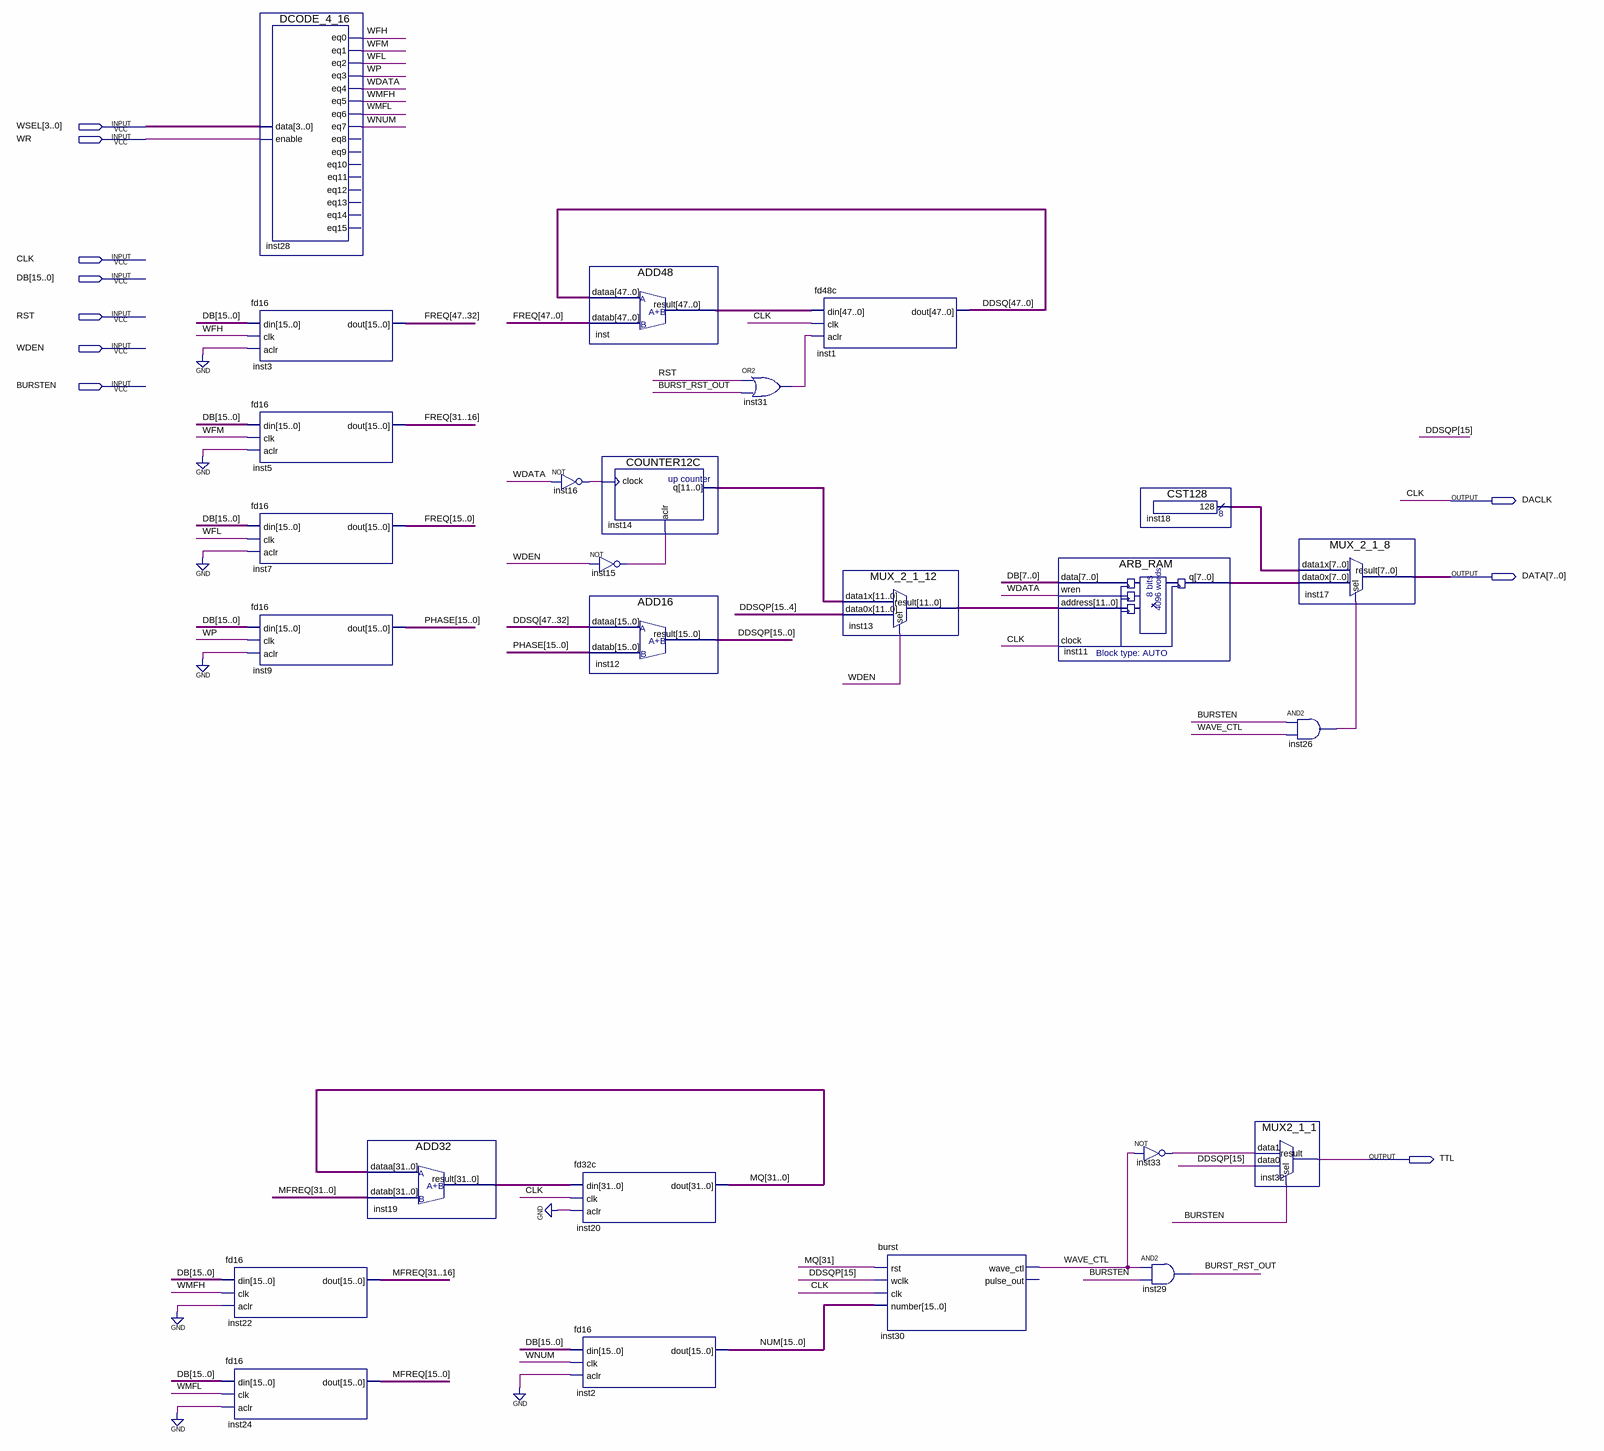
[diagram p0: schematic sheet]
// Quartus schematic DDS.bdf as structural Verilog: 26 symbols, 10 pins
module DDS (
  input  [3:0] WSEL,
  input  WR,
  input  CLK,
  input  [15:0] DB,
  input  RST,
  input  WDEN,
  input  BURSTEN,
  output DACLK,
  output [7:0] DATA,
  output TTL
);

  wire BURST_RST_OUT, inst15_out, inst16_out, inst26_out, inst31_out, inst33_out, WAVE_CTL, WDATA, WFH, WFL,
       WFM, WMFH, WMFL, WNUM, WP;
  wire [7:0] inst11_q, inst18_result;
  wire [11:0] inst13_result, inst14_q;
  wire [15:0] DDSQP, NUM, PHASE;
  wire [31:0] inst19_result, MFREQ, MQ;
  wire [47:0] DDSQ, FREQ, inst_result;

  fd16 inst22 (.din(DB), .clk(WMFH), .aclr(1'b0), .dout(MFREQ[31:16]));
  fd16 inst24 (.din(DB), .clk(WMFL), .aclr(1'b0), .dout(MFREQ[15:0]));
  DCODE_4_16 inst28 (
    .data(WSEL), .enable(WR), .eq0(WFH), .eq1(WFM), .eq2(WFL), .eq3(WP), .eq4(WDATA), .eq5(WMFH), .eq6(WMFL),
    .eq7(WNUM));  // open: eq8, eq9, eq10, eq11, eq12, eq13, eq14, eq15
  fd16 inst3 (.din(DB), .clk(WFH), .aclr(1'b0), .dout(FREQ[47:32]));
  fd16 inst5 (.din(DB), .clk(WFM), .aclr(1'b0), .dout(FREQ[31:16]));
  fd16 inst7 (.din(DB), .clk(WFL), .aclr(1'b0), .dout(FREQ[15:0]));
  fd16 inst9 (.din(DB), .clk(WP), .aclr(1'b0), .dout(PHASE));
  ADD32 inst19 (.dataa(MQ), .datab(MFREQ), .result(inst19_result));
  not inst16 (inst16_out, WDATA);
  fd32c inst20 (.din(inst19_result), .clk(CLK), .aclr(1'b0), .dout(MQ));
  fd16 inst2 (.din(DB), .clk(WNUM), .aclr(1'b0), .dout(NUM));
  ADD48 inst (.dataa(DDSQ), .datab(FREQ), .result(inst_result));
  COUNTER12C inst14 (.clock(inst16_out), .aclr(inst15_out), .q(inst14_q));
  not inst15 (inst15_out, WDEN);
  ADD16 inst12 (.dataa(DDSQ[47:32]), .datab(PHASE), .result(DDSQP));
  or inst31 (inst31_out, RST, BURST_RST_OUT);
  fd48c inst1 (.din(inst_result), .clk(CLK), .aclr(inst31_out), .dout(DDSQ));
  MUX_2_1_12 inst13 (.data1x(inst14_q), .data0x(DDSQP[15:4]), .sel(WDEN), .result(inst13_result));
  burst inst30 (.rst(MQ[31]), .wclk(DDSQP[15]), .clk(CLK), .number(NUM), .wave_ctl(WAVE_CTL));  // open: pulse_out
  ARB_RAM inst11 (.data(DB[7:0]), .wren(WDATA), .address(inst13_result), .clock(CLK), .q(inst11_q));
  not inst33 (inst33_out, WAVE_CTL);
  CST128 inst18 (.result(inst18_result));
  and inst29 (BURST_RST_OUT, WAVE_CTL, BURSTEN);
  and inst26 (inst26_out, BURSTEN, WAVE_CTL);
  MUX2_1_1 inst32 (.data1(inst33_out), .data0(DDSQP[15]), .sel(BURSTEN), .result(TTL));
  MUX_2_1_8 inst17 (.data1x(inst18_result), .data0x(inst11_q), .sel(inst26_out), .result(DATA));

  assign DACLK = CLK;
endmodule
